# EAGLE design temporizador rev1 (EAGLE 8.5.1)
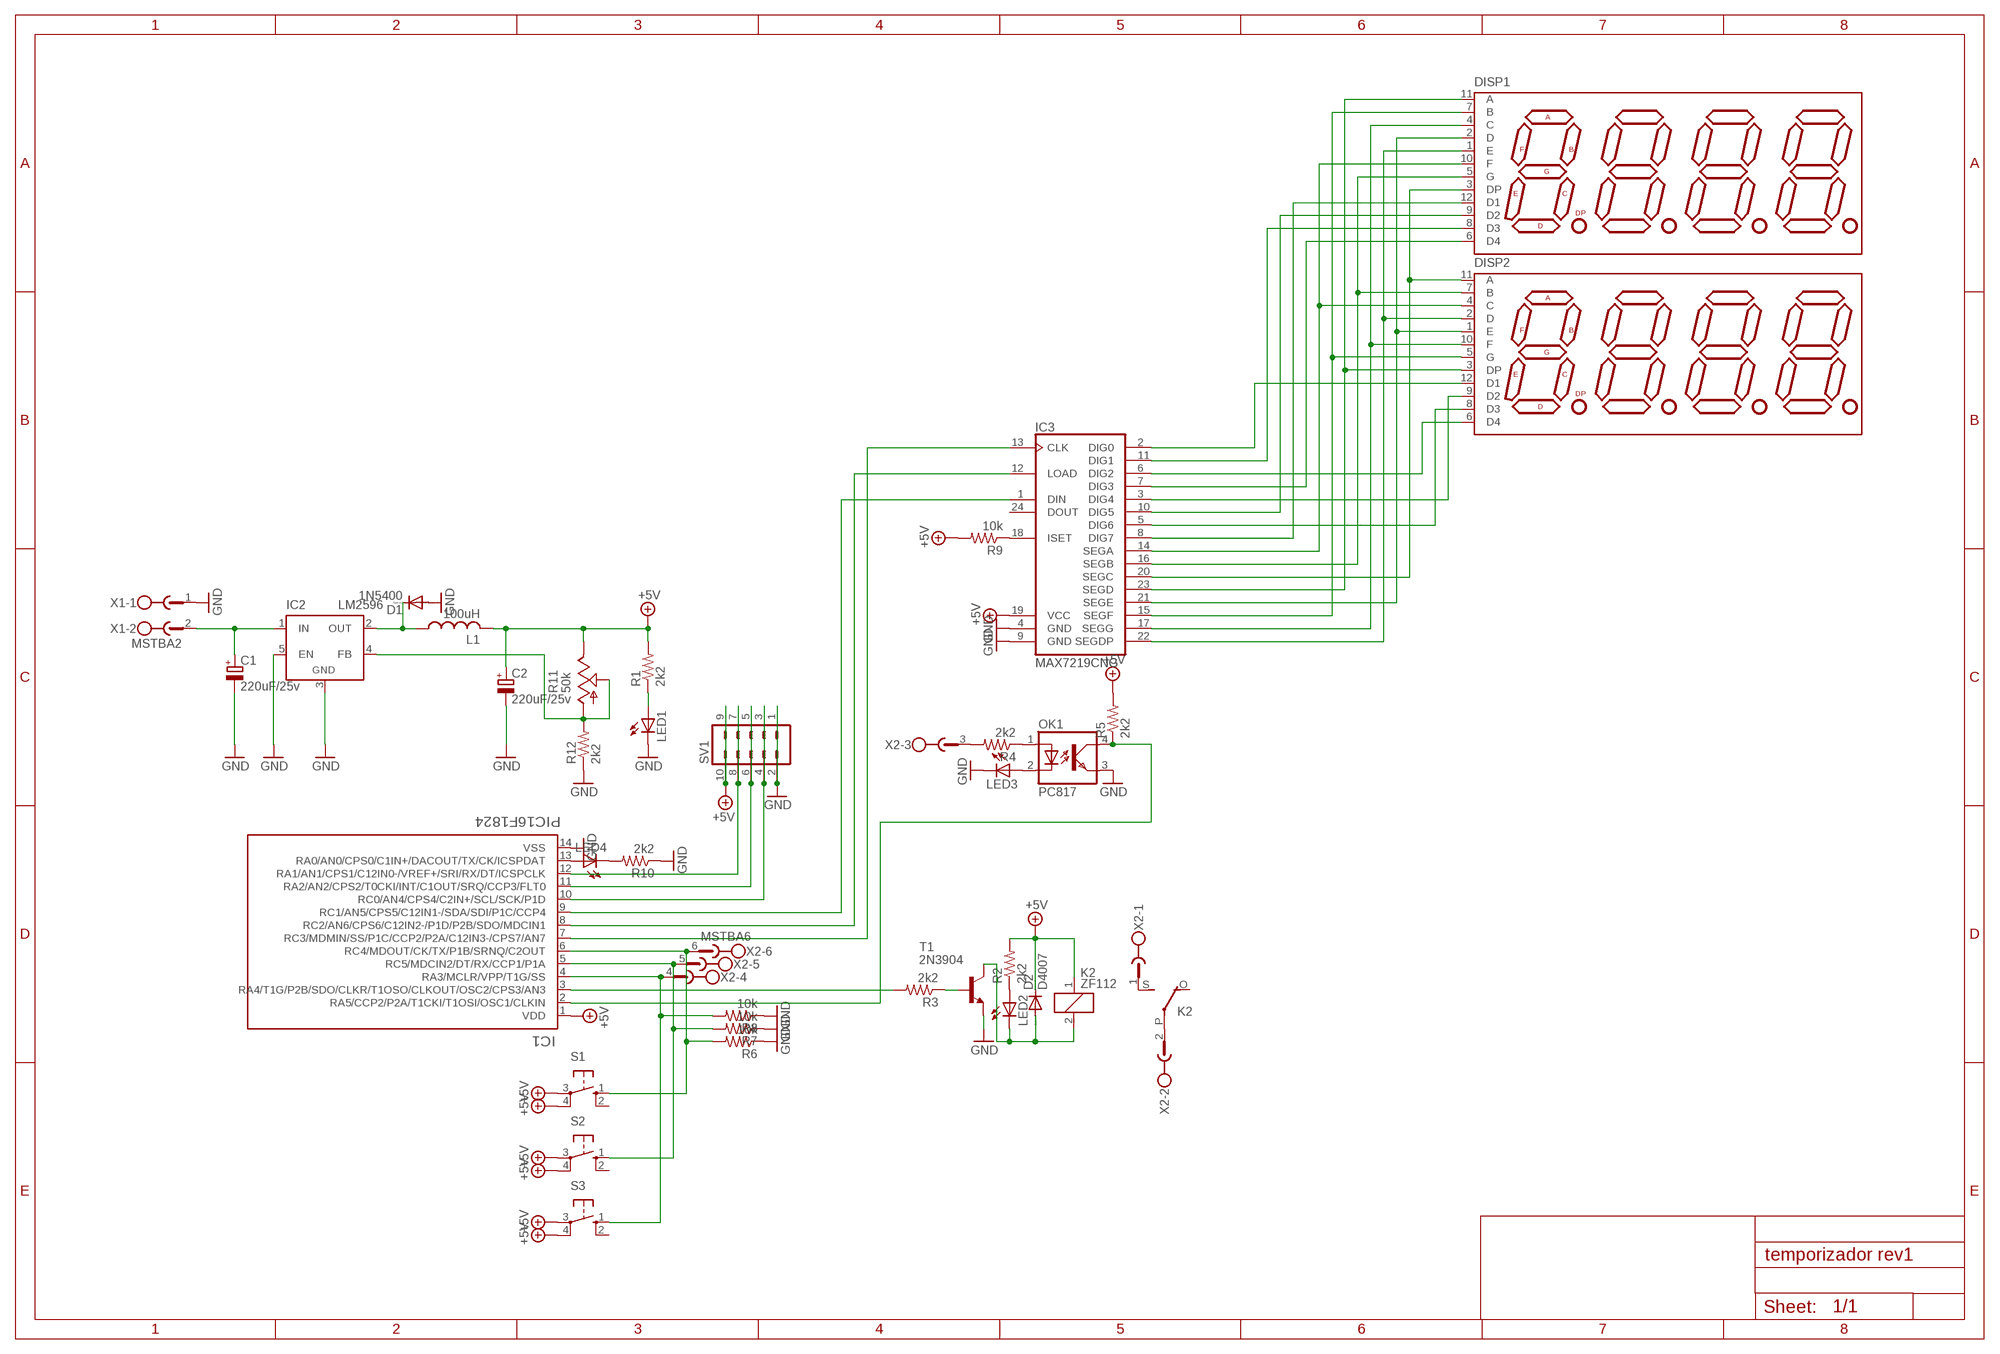
[diagram p0: schematic, sheet 1]

## Parts
C1  220uF/25v  CPOL-EUE3.5-10  [E3,5-10]
C2  220uF/25v  CPOL-EUE3.5-10  [E3,5-10]
D1  1N5400  [DO201-15]
D2  D4007  1N4148DO35-10  [DO35-10]
DISP1  DISP_7SEG_4DIG  [DISP_7SEG_4DIG]
DISP2  DISP_7SEG_4DIG  [DISP_7SEG_4DIG]
IC1  PIC16F1824  [PDIP14_300MC]
IC2  LM2596  LM2596TV  [TO220-51]
IC3  MAX7219CNG  [DIL24-3]
K2  ZF112  [ZF112]
L1  100uH  L-US6000-XXX-RC  [6000-XXXX-RC]
LED1  LED3MM  [LED3MM]
LED2  LED3MM  [LED3MM]
LED3  LED3MM  [LED3MM]
LED4  LED3MM  [LED3MM]
OK1  PC817  [DIL04]
R1  2k2  R-US_0207/10  [0207/10]
R2  2k2  R-US_0207/10  [0207/10]
R3  2k2  R-US_0207/10  [0207/10]
R4  2k2  R-US_0207/10  [0207/10]
R5  2k2  R-US_0207/10  [0207/10]
R6  10k  R-US_0207/10  [0207/10]
R7  10k  R-US_0207/10  [0207/10]
R8  10k  R-US_0207/10  [0207/10]
R9  10k  R-US_R0805  [R0805]
R10  2k2  R-US_0207/10  [0207/10]
R11  50k  TRIM_US-B25P  [B25P]
R12  2k2  R-US_0207/10  [0207/10]
S1  10-XX  [B3F-10XX]
S2  10-XX  [B3F-10XX]
S3  10-XX  [B3F-10XX]
SV1  MA05-2  [MA05-2]
T1  2N3904  2N3904-NPN-TO92-EBC  [TO92-EBC]
X1  MSTBA2  [MSTBA2]
X2  MSTBA6  [MSTBA6]

## Nets
+5V: C2.+ D2.C IC1.1(VDD) IC3.19(VCC) K2.1 L1.2 R1.2 R2.2 R5.2 R9.2 R11.E S1.3(P) S1.4(P1) S2.3(P) S2.4(P1) S3.3(P) S3.4(P1) SV1.9 SV1.10
GND: C1.- C2.- D1.A IC1.14(VSS) IC2.3(GND) IC2.5(EN) IC3.4(GND) IC3.9(GND) LED1.K(C) LED3.K(C) OK1.3(EMIT) R6.1 R7.1 R8.1 R10.1 R12.1 SV1.1 SV1.2 T1.E X1.1
N$1: LED1.A R1.1
N$2: C1.+ IC2.1(IN) X1.2
N$3: D1.C IC2.2(OUT) L1.1
N$4: DISP1.3(DP) DISP2.11(A) IC3.20(SEGC)
N$5: DISP1.2(D) DISP2.1(E) IC3.21(SEGE)
N$6: DISP1.1(E) DISP2.2(D) IC3.22(SEGDP)
N$7: DISP1.4(C) DISP2.10(F) IC3.17(SEGG)
N$8: IC3.18(ISET) R9.1
N$9: DISP1.5(G) DISP2.7(B) IC3.16(SEGB)
N$10: DISP1.11(A) DISP2.3(DP) IC3.23(SEGD)
N$11: DISP1.7(B) DISP2.5(G) IC3.15(SEGF)
N$12: LED2.A R2.1
N$13: R3.1 T1.B
N$14: D2.A K2.2 LED2.K(C) T1.C
N$15: OK1.1(A) R4.1
N$16: LED3.A OK1.2(C)
N$17: IC1.6(RC4/MDOUT/CK/TX/P1B/SRNQ/C2OUT) R6.2 S1.1(S) X2.6
N$18: IC1.3(RA4/T1G/P2B/SDO/CLKR/T1OSO/CLKOUT/OSC2/CPS3/AN3) R3.2
N$19: IC1.2(RA5/CCP2/P2A/T1CKI/T1OSI/OSC1/CLKIN) OK1.4(COL) R5.1
N$20: IC1.5(RC5/MDCIN2/DT/RX/CCP1/P1A) R7.2 S2.1(S) X2.5
N$21: IC1.4(RA3/MCLR/VPP/T1G/SS) R8.2 S3.1(S) X2.4
N$22: DISP1.10(F) DISP2.4(C) IC3.14(SEGA)
N$23: IC1.8(RC2/AN6/CPS6/C12IN2-/P1D/P2B/SDO/MDCIN1) IC3.12(LOAD)
N$24: IC1.9(RC1/AN5/CPS5/C12IN1-/SDA/SDI/P1C/CCP4) IC3.1(DIN)
N$25: IC1.7(RC3/MDMIN/SS/P1C/CCP2/P2A/C12IN3-/CPS7/AN7) IC3.13(CLK)
N$26: K2.S(2:S) X2.1
N$27: K2.P(2:P) X2.2
N$28: R4.2 X2.3
N$29: IC1.13(RA0/AN0/CPS0/C1IN+/DACOUT/TX/CK/ICSPDAT) LED4.A
N$30: LED4.K(C) R10.2
N$31: IC1.12(RA1/AN1/CPS1/C12IN0-/VREF+/SRI/RX/DT/ICSPCLK) SV1.7 SV1.8
N$32: IC1.11(RA2/AN2/CPS2/T0CKI/INT/C1OUT/SRQ/CCP3/FLT0) SV1.5 SV1.6
N$33: IC1.10(RC0/AN4/CPS4/C2IN+/SCL/SCK/P1D) SV1.3 SV1.4
N$34: DISP1.6(D4) IC3.7(DIG3)
N$35: DISP1.12(D1) IC3.8(DIG7)
N$36: DISP1.9(D2) IC3.10(DIG5)
N$37: DISP1.8(D3) IC3.11(DIG1)
N$38: DISP2.6(D4) IC3.6(DIG2)
N$39: DISP2.8(D3) IC3.5(DIG6)
N$40: DISP2.9(D2) IC3.3(DIG4)
N$41: DISP2.12(D1) IC3.2(DIG0)
N$42: IC2.4(FB) R11.A R11.S R12.2
Unconnected: IC3.24(DOUT) K2.O(2:O) S1.2(S1) S2.2(S1) S3.2(S1)

## Library data of the parts
C1 C2 = rcl:CPOL-EU: POLARIZED CAPACITOR, European symbol; SPICEPREFIX: C
D1 = diode:1N5400: DIODE standard rectifier, 3 A, 50 V (Motorola)
D2 = diode:1N4148: DIODE high speed (Philips)
DISP1 DISP2 = makerelectronico:DISP_7SEG_4DIG: Display 7 segment 4 digit code datasheet: FJ5461AH
IC1 = PIC16F1824:PIC16F1824: Características PIC16F1824: Memoria Programa (FLASH): 7 KB. Memoria RAM: 256 Bytes. Memoria EEPROM: 256 Bytes. CPU speed: 32Mhz. Comunicación: UART, I2C, SPI. Salidas PWM: 4 (2 CCP/ 2 ECCP). Temporizador 8Bits: 4. Temporizador 16Bits: 1. Convertidor ADC 10bits: 8. Librerías de EC ELECTRONIC DEVELOPER EIRL Visitar www.MakerElectronico.com para mas información.
IC2 = linear:LM2596T: STEP-DOWN VOLTAGE REGULATOR
IC3 = maxim:MAX7219CNG: LED DISPLAY DRIVER; MF: MAXIM; MPN: MAX7219CNG; OC_FARNELL: 1523914; OC_NEWARK: 34C4018
K2 = relay:ZF112: RELAY 1 x switch; OC_FARNELL: unknown; OC_NEWARK: unknown
L1 = rcl:L-US: INDUCTOR, American symbol; SPICEPREFIX: L
LED1-LED4 = led:LED: LED OSRAM: - CHIPLED LG R971, LG N971, LY N971, LG Q971, LY Q971, LO R971, LY R971 LH N974, LH R974 LS Q976, LO Q976, LY Q976 LO Q996 - Hyper CHIPLED LW Q18S LB Q993, LB Q99A, LB R99A - SideLED LS A670, LO A670, LY A670, LG A670, LP A670 LB A673, LV A673, LT A673, LW A673 LH A674 LY A675 LS A676, LA A676, LO A676, LY A676, LW A676 LS A679, LY A679, LG A679 - Hyper Micro SIDELED® LS Y876, LA Y876, LO Y876, LY Y876 LT Y87S - SmartLED LW L88C, LW L88S LB L89C, LB L89S, LG L890 LS L89K, LO L89K, LY L89K LS L896, LA L896, LO L896, LY L896 - TOPLED LS T670, LO T670, LY T670, LG T670, LP T670 LSG T670, LSP T670, LSY T670, LOP T670, LYG T670 LG T671, LOG T671, LSG T671 LB T673, LV T673, LT T673, LW T673 LH T674 LS T676, LA T676, LO T676, LY T676, LB T676, LH T676, LSB T676, LW T676 LB T67C, LV T67C, LT T67C, LS T67K, LO T67K, LY T67K, LW E67C LS E67B, LA E67B, LO E67B, LY E67B, LB E67C, LV E67C, LT E67C LW T67C LS T679, LY T679, LG T679 LS T770, LO T770, LY T770, LG T770, LP T770 LB T773, LV T773, LT T773, LW T773 LH T774 LS E675, LA E675, LY E675, LS T675 LS T776, LA T776, LO T776, LY T776, LB T776 LHGB T686 LT T68C, LB T68C - Hyper Mini TOPLED® LB M676 - Mini TOPLED Santana® LG M470 LS M47K, LO M47K, LY M47K Source: http://www.osram.convergy.de LUXEON: - LUMILED® LXK2-PW12-R00, LXK2-PW12-S00, LXK2-PW14-U00, LXK2-PW14-V00 LXK2-PM12-R00, LXK2-PM12-S00, LXK2-PM14-U00 LXK2-PE12-Q00, LXK2-PE12-R00, LXK2-PE12-S00, LXK2-PE14-T00, LXK2-PE14-U00 LXK2-PB12-K00, LXK2-PB12-L00, LXK2-PB12-M00, LXK2-PB14-N00, LXK2-PB14-P00, LXK2-PB14-Q00 LXK2-PR12-L00, LXK2-PR12-M00, LXK2-PR14-Q00, LXK2-PR14-R00 LXK2-PD12-Q00, LXK2-PD12-R00, LXK2-PD12-S00 LXK2-PH12-R00, LXK2-PH12-S00 LXK2-PL12-P00, LXK2-PL12-Q00, LXK2-PL12-R00 Source: www.luxeon.com KINGBRIGHT: KA-3528ASYC Source: www.kingbright.com
OK1 = optocoupler:PC817: SHARP OPTO COUPLER; MPN: PC817X4J000F; OC_FARNELL: 9707727; OC_NEWARK: 97K7059
R1-R10 R12 = rcl:R-US_: RESISTOR, American symbol; SPICEPREFIX: R
R11 = pot:TRIM_US-: POTENTIOMETER
S1-S3 = switch-omron:10-XX: OMRON SWITCH; MPN: B3F-1000; OC_FARNELL: 176432; OC_NEWARK: 36M3542
SV1 = con-lstb:MA05-2: PIN HEADER; OC_FARNELL: unknown; OC_NEWARK: unknown
T1 = transistor-neu-to92:*-NPN-: NPN Transistror
X1 = con-phoenix-508:MSTBA2: PHOENIX; MF: FARNELL; MPN: 1757242; OC_FARNELL: 3705171; OC_NEWARK: 71C4161
X2 = con-phoenix-508:MSTBA6: PHOENIX; MF: FARNELL; MPN: 1757284; OC_FARNELL: 3705213; OC_NEWARK: 71C4165

## Board
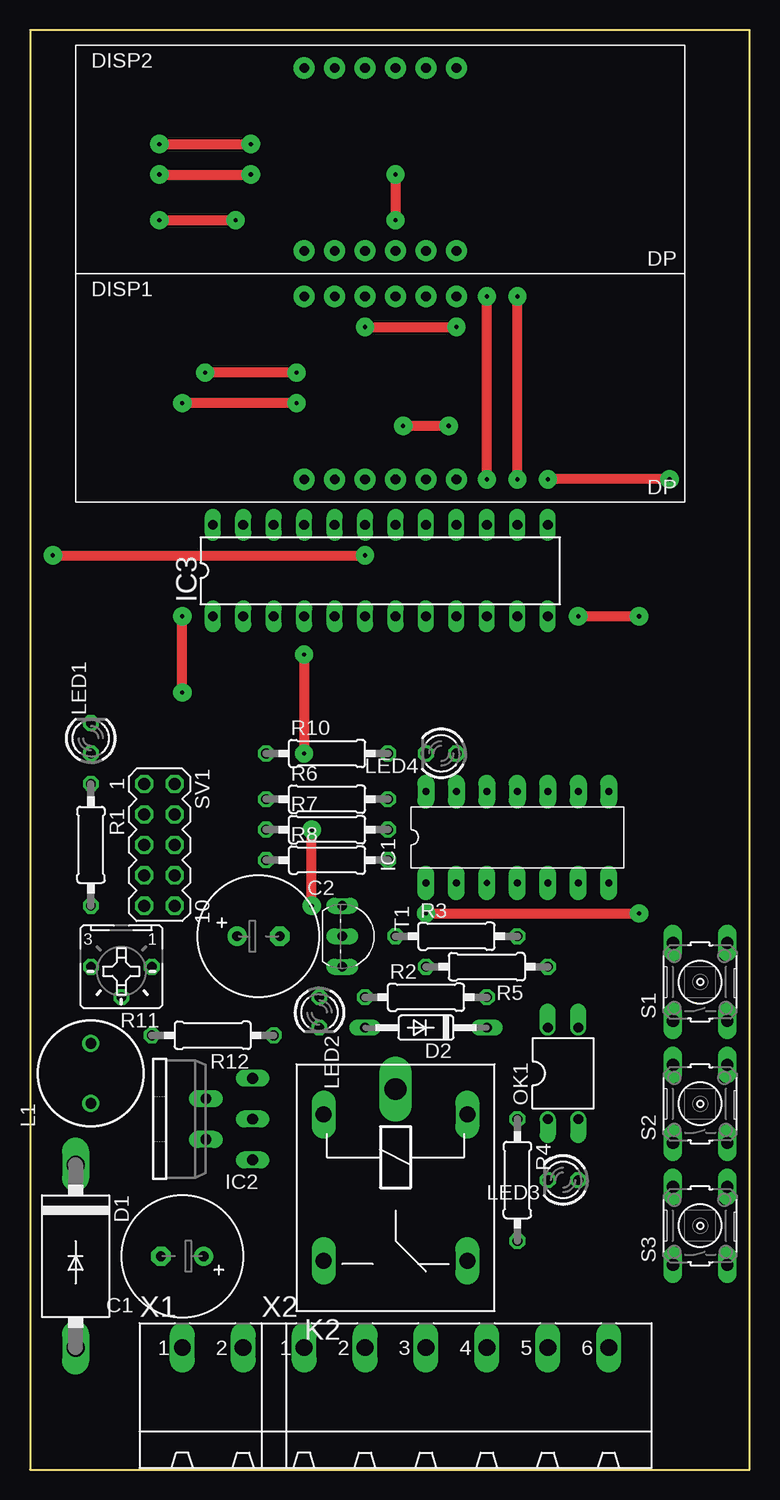
[diagram p1: board, top side]
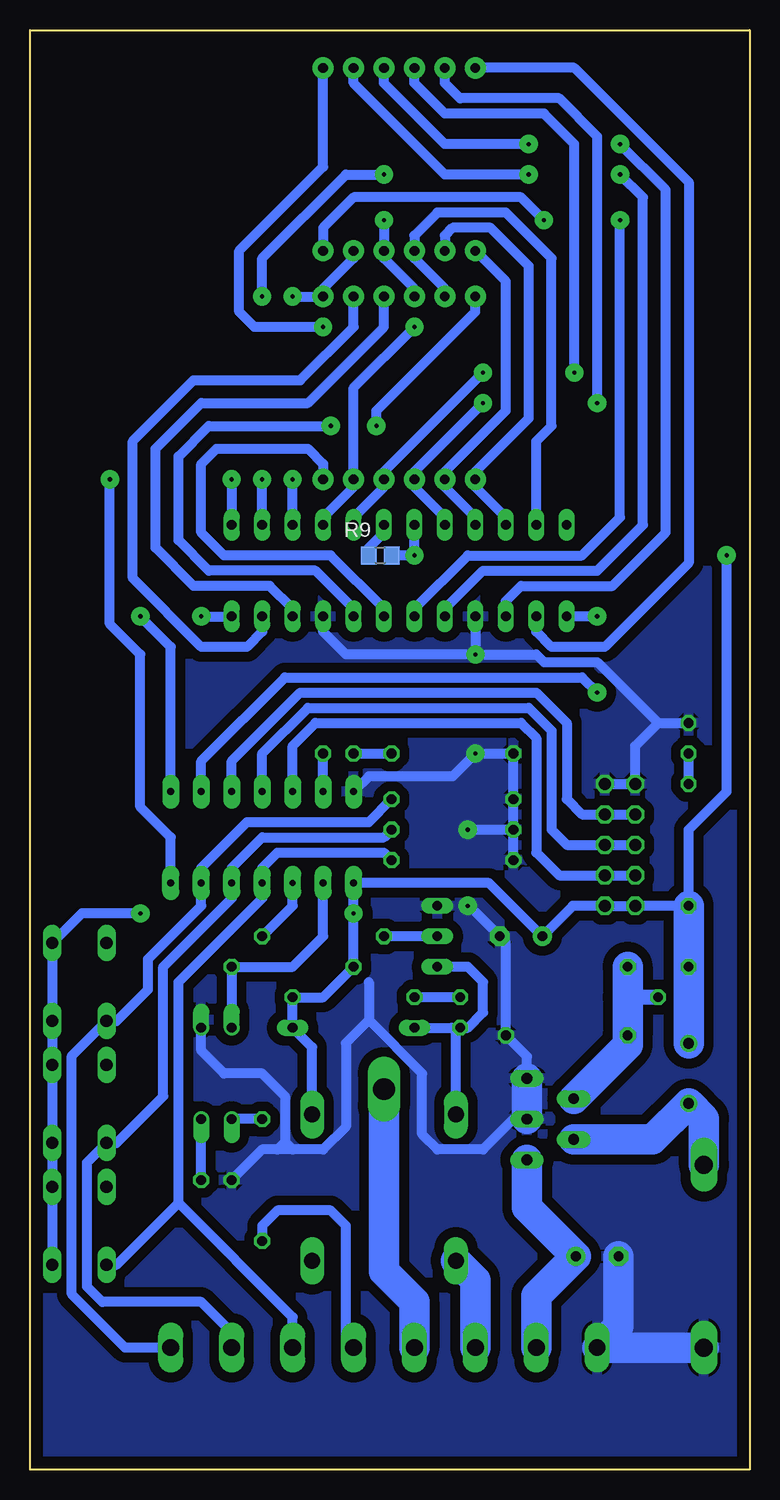
[diagram p2: board, bottom side, seen from below]

Size 60 x 120 mm. Coordinates in mm from the lower left corner, seen from the top.
Outline: 0,0 60,0 60,120 0,120 0,0
Copper layers (1*16): Top 0.035mm / dielectric 1.5mm / Bottom 0.035mm
Design rules "default": minimum track width 6mil, minimum drill 0.35mm, track to track 6mil, track to pad 6mil, pad to pad 6mil, via to via 6mil, smd to smd 6mil, copper to edge 40mil, drill to drill 6mil, minimum pad ring 10mil, minimum via ring 8mil, stop-mask expansion 4mil, vias tented up to drill 0mil, thermal gap 10mil

### Footprints (pad centres in the part's own frame; a part is rotated, then mirrored left to right if it is on the bottom)
E3,5-10 = drill 0.813 pad 1.6: + -1.778,0 | drill 0.813 pad 1.6 octagon: - 1.778,0
DO201-15 = drill 1.499 long: A 7.62,0; C -7.62,0
DO35-10 = drill 0.813 long: A 5.08,0; C -5.08,0
DISP_7SEG_4DIG = drill 0.8 pad 1.778: 1 -6.35,-7.62; 2 -3.81,-7.62; 3 -1.27,-7.62; 4 1.27,-7.62; 5 3.81,-7.62; 6 6.35,-7.62; 7 6.35,7.62; 8 3.81,7.62; 9 1.27,7.62; 10 -1.27,7.62; 11 -3.81,7.62; 12 -6.35,7.62
PDIP14_300MC = drill 0.6 pad 1.422 long: 1 -3.81,7.62; 2 -3.81,5.08; 4 -3.81,0; 5 -3.81,-2.54; 6 -3.81,-5.08; 7 -3.81,-7.62; 8 3.81,-7.62; 9 3.81,-5.08; 10 3.81,-2.54; 11 3.81,0; 12 3.81,2.54; 13 3.81,5.08; 14 3.81,7.62 | drill 0.5 pad 1.422 long: 3 -3.81,2.54
TO220-51 = drill 0.9 long: 1 -3.4,-8.4; 2 -1.7,-4.5; 3 0,-8.4; 4 1.7,-4.5; 5 3.4,-8.4
DIL24-3 = drill 0.813 long: 1 -13.97,-3.81; 2 -11.43,-3.81; 3 -8.89,-3.81; 4 -6.35,-3.81; 5 -3.81,-3.81; 6 -1.27,-3.81; 7 1.27,-3.81; 8 3.81,-3.81; 9 6.35,-3.81; 10 8.89,-3.81; 11 11.43,-3.81; 12 13.97,-3.81; 13 13.97,3.81; 14 11.43,3.81; 15 8.89,3.81; 16 6.35,3.81; 17 3.81,3.81; 18 1.27,3.81; 19 -1.27,3.81; 20 -3.81,3.81; 21 -6.35,3.81; 22 -8.89,3.81; 23 -11.43,3.81; 24 -13.97,3.81
ZF112 = drill 1.321 long: 1 -6.096,5.994; 2 -6.096,-5.994; O 6.096,5.994; S 6.096,-5.994 | drill 1.803 long: P -8.204,0
6000-XXXX-RC = drill 0.9 pad 1.422: 1 -2.5,0; 2 2.5,0
LED3MM = drill 0.813 octagon: A -1.27,0; K 1.27,0
DIL04 = drill 0.813 offset: 1 -1.27,-3.81; 2 1.27,-3.81; 3 1.27,3.81; 4 -1.27,3.81
0207/10 = drill 0.813 octagon: 1 -5.08,0; 2 5.08,0
R0805 = smd 1.3 x 1.5: 1 -0.95,0; 2 0.95,0
B25P = drill 0.813 octagon: A -2.54,0; E 2.54,0; S 0,2.54
B3F-10XX = drill 1.016 long: 1 -3.251,2.261; 2 3.251,2.261; 3 -3.251,-2.261; 4 3.251,-2.261
MA05-2 = drill 1.016 octagon: 1 -5.08,-1.27; 2 -5.08,1.27; 3 -2.54,-1.27; 4 -2.54,1.27; 5 0,-1.27; 6 0,1.27; 7 2.54,-1.27; 8 2.54,1.27; 9 5.08,-1.27; 10 5.08,1.27
TO92-EBC = drill 0.813 long: B 0,-1.27; C 2.54,-1.27; E -2.54,-1.27
MSTBA2 = drill 1.397 long: 1 -2.54,5.08; 2 2.54,5.08
MSTBA6 = drill 1.397 long: 1 -12.7,5.08; 2 -7.62,5.08; 3 -2.54,5.08; 4 2.54,5.08; 5 7.62,5.08; 6 12.7,5.08

### Placement (x,y rotation side)
C1  12.7,17.78 180 top
C2  19.05,44.45 0 top
D1  3.81,17.78 270 top
D2  33.02,36.83 180 top
DISP1  29.21,90.17 0 top
DISP2  29.21,109.22 0 top
IC1  40.64,52.7 90 top
IC2  10.16,29.21 90 top
IC3  29.21,74.93 0 top
K2  30.48,23.5 270 top
L1  5.08,33.02 90 top
LED1  5.08,60.96 90 top
LED2  24.13,38.1 270 top
LED3  44.45,24.13 180 top
LED4  34.29,59.69 180 top
OK1  44.45,33.02 0 top
R1  5.08,52.07 270 top
R2  33.02,39.37 0 top
R3  35.56,44.45 0 top
R4  40.64,24.13 270 top
R5  38.1,41.91 180 top
R6  24.77,55.88 0 top
R7  24.77,53.34 0 top
R8  24.77,50.8 0 top
R9  30.8,76.2 0 bottom
R10  24.77,59.69 0 top
R11  7.62,41.91 180 top
R12  15.24,36.2 180 top
S1  55.88,40.64 90 top
S2  55.88,30.48 90 top
S3  55.88,20.32 90 top
SV1  10.79,52.07 270 top
T1  27.3,44.45 270 top
X1  15.24,5.08 0 top
X2  35.56,5.08 0 top

### Tracks (layer width: path | path; a pad name or v marks a point on that pad's centre or on a via)
+5V  (via drill 0.35 pad 1.52)
  Top 0.813: v33.02,46.35 v50.8,46.35 | v1.91,76.2 v27.94,76.2
  Bottom 0.813: K2.1 36.47,35.2 D2.C R2.2 35.56,39.37 R5.2 v33.02,46.35 IC1.1 21.72,48.9 C2.+ 14.73,46.99 SV1.10 SV1.9 R1.2 5.08,53.34 1.91,56.52 v1.91,76.2 | S3.3 S3.4 S2.3 S2.4 S1.3 S1.4 55.68,46.35 v50.8,46.35 | IC3.19 v27.94,76.2 R9.2
  Bottom 2.54: L1.2 R11.E R1.2
GND  (via drill 0.35 pad 1.52)
  Top 0.813: v22.86,67.94 v22.86,59.69 | v23.5,46.99 v23.5,53.34
  Bottom 0.813: OK1.3 45.72,34.92 43.81,33.02 40.64,33.02 38.73,31.11 38.73,27.3 | 38.1,26.67 35.56,26.67 33.66,28.57 33.66,35.56 31.75,37.47 | 38.1,26.67 39.37,26.67 | 39.37,26.67 40.64,26.67 LED3.K | 38.73,27.3 39.37,26.67 | 38.73,27.3 38.1,26.67 | R8.1 R7.1 | R7.1 R6.1 R10.1 v22.86,59.69 24.77,57.78 31.75,57.78 IC1.14 | SV1.2 SV1.1 9.53,60.33 7.62,62.23 | IC2.5 18.56,34.44 R12.1 20.32,43.94 C2.- 23.37,46.99 v23.5,46.99 | 7.62,62.23 LED1.K | IC2.3 19.68,29.21 22.23,26.67 26.04,26.67 27.3,27.94 27.3,33.02 31.75,37.47 | 31.75,40.64 31.75,37.47 | IC3.4 v22.86,67.94 | 7.62,62.23 12.7,67.31 17.14,67.31 17.78,67.94 v22.86,67.94 | v23.5,53.34 R7.1 | v22.86,67.94 33.66,67.94 35.56,69.85 IC3.9
  Bottom 2.54: IC2.3 IC2.5 | C1.- 10.92,11.94 X1.1 D1.A
  pour Bottom (isolate 0.813): 0,0 60.33,0 60.33,120.02 0,120.02
N$1
  Bottom 0.813: R1.1 LED1.A
N$2
  Bottom 2.54: X1.2 17.78,14.48 C1.+ 18.56,21.86 IC2.1
N$3
  Bottom 2.54: D1.C 3.81,29.25 L1.1 8.09,27.51 IC2.2
N$4  (via drill 0.35 pad 1.52)
  Top 0.813: v22.23,88.9 v12.7,88.9
  Bottom 0.813: IC3.20 25.4,79.38 27.94,81.92 DISP1.3 27.94,83.19 v22.23,88.9 | DISP2.11 25.4,115.57 24.13,114.3 15.88,114.3 12.7,111.12 v12.7,88.9
N$5
  Bottom 0.813: IC3.21 22.86,79.38 25.4,81.92 DISP1.2 25.4,83.19 20.32,88.27 20.32,99.06 DISP2.1
N$6
  Bottom 0.813: IC3.22 20.32,79.38 22.86,81.92 DISP1.1 22.86,83.19 18.41,87.63 18.41,100.33 21.59,103.5 24.77,103.5 25.4,102.87 DISP2.2
N$7  (via drill 0.35 pad 1.52)
  Top 0.813: v22.23,91.44 v14.61,91.44
  Bottom 0.813: IC3.17 33.02,79.38 30.48,81.92 DISP1.4 30.48,83.19 v22.23,91.44 | DISP2.10 27.94,115.57 25.4,113.03 17.14,113.03 14.61,110.49 v14.61,91.44
N$8
  Bottom 0.813: R9.1 31.75,76.84 30.48,78.11 IC3.18
N$9  (via drill 0.35 pad 1.52)
  Top 0.813: v27.94,95.25 v35.56,95.25
  Bottom 0.813: IC3.16 35.56,79.38 33.02,81.92 DISP1.5 33.02,90.17 v27.94,95.25 | v35.56,95.25 41.27,95.25 42.55,96.52 42.55,101.6 35.56,108.58 DISP2.7
N$10
  Bottom 0.813: IC3.23 17.78,85.72 16.51,87 16.51,100.97 20.32,104.78 26.04,104.78 27.94,102.87 DISP2.3 27.94,100.97 25.4,98.42 DISP1.11
N$11  (via drill 0.35 pad 1.52)
  Top 0.813: v38.1,82.55 v38.1,97.79
  Bottom 0.813: DISP2.5 33.02,100.97 35.56,98.42 DISP1.7 v38.1,97.79 | IC3.15 v38.1,82.55
N$12
  Bottom 0.813: LED2.A R2.1
N$13
  Bottom 0.813: T1.B R3.1
N$14
  Bottom 0.813: K2.2 24.49,36.47 | 24.49,36.47 LED2.K 23.5,36.83 22.23,38.1 22.23,40.64 23.5,41.91 T1.C | D2.A 24.84,36.83 24.49,36.47
N$15
  Bottom 0.813: R4.1 OK1.1
N$16
  Bottom 0.813: LED3.A OK1.2
N$17
  Bottom 0.813: X2.6 52.07,10.16 56.52,14.61 56.52,34.49 S1.1 52.78,37.39 50.16,40.01 50.16,42.55 45.72,46.99 IC1.6 45.72,50.16 41.91,53.98 31.75,53.98 R6.2
N$18
  Bottom 0.813: R3.2 38.1,46.99 IC1.3
N$19
  Bottom 0.813: OK1.4 R5.1 38.1,41.91 35.56,44.45 IC1.2
N$20
  Bottom 0.813: X2.5 43.18,11.43 45.72,13.97 53.98,13.97 55.24,15.24 55.24,25.6 S2.1 52.78,27.23 48.9,31.11 48.9,41.91 43.18,47.62 IC1.5 43.18,50.16 40.64,52.7 30.48,52.7 R7.2
N$21
  Bottom 0.813: X2.4 38.1,12.7 47.62,22.23 | 47.62,22.23 47.62,40.64 40.64,47.62 IC1.4 40.64,50.16 39.37,51.44 30.48,51.44 R8.2 | S3.1 52.78,17.07 47.62,22.23
N$22  (via drill 0.35 pad 1.52)
  Top 0.813: v40.64,82.55 v40.64,97.79 | v30.48,107.95 v30.48,104.14
  Bottom 0.813: DISP1.10 27.94,98.42 30.48,100.97 DISP2.4 v30.48,104.14 | IC3.14 v40.64,82.55 | v40.64,97.79 40.64,100.97 33.66,107.95 v30.48,107.95
N$23  (via drill 0.35 pad 1.52)
  Top 0.813: v50.8,71.12 v45.72,71.12
  Bottom 0.813: IC1.8 48.26,68.58 v50.8,71.12 | v45.72,71.12 IC3.12
N$24  (via drill 0.35 pad 1.52)
  Top 0.813: v12.7,64.77 v12.7,71.12
  Bottom 0.813: IC1.9 45.72,59.05 38.73,66.04 13.97,66.04 v12.7,64.77 | v12.7,71.12 IC3.1
N$25  (via drill 0.35 pad 1.52)
  Top 0.813: v53.34,82.55 v43.18,82.55
  Bottom 0.813: IC1.7 48.26,52.7 50.8,55.24 50.8,67.94 53.34,70.48 v53.34,82.55 | v43.18,82.55 IC3.13
N$26
  Bottom 2.54: X2.1 22.86,15.77 K2.S
N$27
  Bottom 2.54: K2.P 30.48,16.51 27.94,13.97 X2.2
N$28
  Bottom 0.813: X2.3 33.66,10.79 33.66,20.32 34.92,21.59 39.37,21.59 40.64,20.32 R4.2
N$29
  Bottom 0.813: IC1.13 LED4.A
N$30
  Bottom 0.813: LED4.K R10.2
N$31
  Bottom 0.813: IC1.12 38.1,60.33 36.2,62.23 19.05,62.23 17.78,60.96 17.78,51.44 15.88,49.53 SV1.8 SV1.7
N$32
  Bottom 0.813: IC1.11 40.64,59.69 36.83,63.5 18.41,63.5 16.51,61.59 16.51,53.34 15.24,52.07 SV1.6 SV1.5
N$33
  Bottom 0.813: IC1.10 43.18,59.05 37.47,64.77 17.78,64.77 15.24,62.23 15.24,55.88 13.97,54.61 SV1.4 SV1.3
N$34
  Bottom 0.813: DISP1.6 35.56,83.82 36.83,85.09 44.45,85.09 45.72,83.82 45.72,78.11 43.81,76.2 34.92,76.2 30.48,71.75 IC3.7
N$35  (via drill 0.35 pad 1.52)
  Top 0.813: v34.92,87 v31.11,87
  Bottom 0.813: v34.92,87 45.09,87 47.62,84.45 47.62,77.47 45.09,74.93 36.2,74.93 33.02,71.75 IC3.8 | v31.11,87 31.11,88.27 22.86,96.52 DISP1.12
N$36
  Bottom 0.813: IC3.10 38.1,71.75 40.01,73.66 46.35,73.66 49.53,76.83 49.53,85.09 45.72,88.9 36.83,88.9 30.48,95.25 DISP1.9
N$37
  Bottom 0.813: DISP1.8 33.02,95.25 37.47,90.81 46.35,90.81 51.44,85.72 51.44,74.3 45.72,68.58 41.91,68.58 40.64,69.85 IC3.11
N$38  (via drill 0.35 pad 1.52)
  Top 0.813: v10.79,104.14 v17.14,104.14
  Bottom 0.813: v17.14,104.14 19.05,106.05 33.02,106.05 35.56,103.5 DISP2.6 | IC3.6 27.94,71.75 23.5,76.2 13.97,76.2 10.79,79.38 v10.79,104.14
N$39  (via drill 0.35 pad 1.52)
  Top 0.813: v10.79,107.95 v18.41,107.95
  Bottom 0.813: v10.79,107.95 8.89,106.05 8.89,78.74 12.7,74.93 22.23,74.93 25.4,71.75 IC3.5 | v18.41,107.95 25.4,107.95 33.02,115.57 DISP2.8
N$40  (via drill 0.35 pad 1.52)
  Top 0.813: v10.79,110.49 v18.41,110.49
  Bottom 0.813: v10.79,110.49 6.99,106.68 6.99,78.11 11.43,73.66 19.05,73.66 20.32,72.39 IC3.3 | v18.41,110.49 25.4,110.49 30.48,115.57 DISP2.9
N$41
  Bottom 0.813: DISP2.12 14.61,116.84 5.08,107.31 5.08,75.56 12.06,68.58 16.51,68.58 17.78,69.85 IC3.2
N$42
  Bottom 1.27: R11.S 10.16,39.37
  Bottom 2.54: IC2.4 10.16,35.41 R12.2 10.16,39.37 R11.A